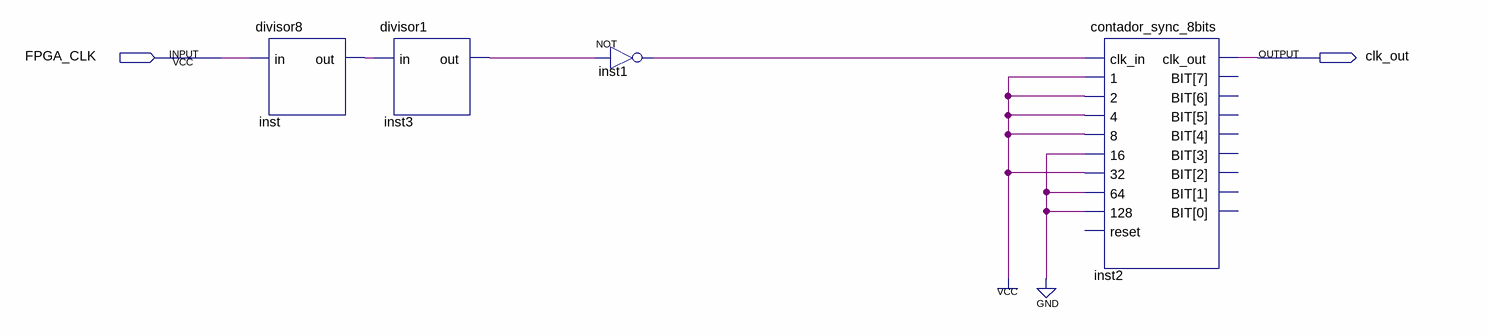
[diagram p0: schematic sheet]
// Quartus schematic freq_1046hz.bdf as structural Verilog: 4 symbols, 2 pins
module freq_1046hz (
  input  FPGA_CLK,
  output clk_out
);

  wire inst1_out, inst3_out, inst_out;

  divisor8 inst (.in(FPGA_CLK), .out(inst_out));
  divisor1 inst3 (.in(inst_out), .out(inst3_out));
  not inst1 (inst1_out, inst3_out);
  contador_sync_8bits inst2 (
    .clk_in(inst1_out), .\1 (1'b1), .\2 (1'b1), .\4 (1'b1), .\8 (1'b1), .\16 (1'b0), .\32 (1'b1),
    .\64 (1'b0), .\128 (1'b0), .clk_out(clk_out));  // open: reset, BIT
endmodule
